# EAGLE design untitled (EAGLE 9.6.0)
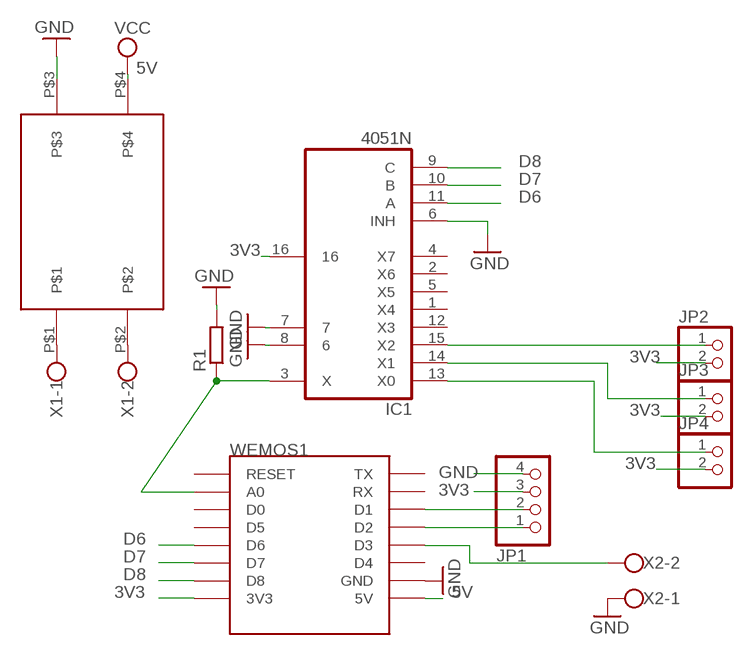
[diagram p0: schematic, sheet 1]

## Parts
IC1  4051N  [DIL16]
JP1  PINHD-1X4  [1X04]
JP2  PINHD-1X2  [1X02]
JP3  PINHD-1X2  [1X02]
JP4  PINHD-1X2  [1X02]
R1  R-EU_0207/10  [0207/10]
U$6  HLK-PM01  [HLK-PM01]
WEMOS1  WEMOS-D1-MINI  [WEMOS-D1-MINI]
X1  W237-102  [W237-102]
X2  W237-102  [W237-102]

## Nets
3V3: IC1.16 JP1.3 JP2.2 JP3.2 JP4.2 WEMOS1.3V3
5V: U$6.P$4 WEMOS1.5V ; supply symbol labelled VCC
D6: IC1.11(A) WEMOS1.D6
D7: IC1.10(B) WEMOS1.D7
D8: IC1.9(C) WEMOS1.D8
GND: IC1.6(INH) IC1.7 IC1.8 JP1.4 R1.2 U$6.P$3 WEMOS1.GND X2.1
N$1: IC1.3(X) R1.1 WEMOS1.A0
N$2: IC1.13(X0) JP4.1
N$3: IC1.14(X1) JP3.1
N$4: IC1.15(X2) JP2.1
N$5: JP1.1 WEMOS1.D2
N$6: JP1.2 WEMOS1.D1
N$7: U$6.P$1 X1.1
N$8: U$6.P$2 X1.2
N$9: WEMOS1.D3 X2.2
Unconnected: IC1.1(X4) IC1.2(X6) IC1.4(X7) IC1.5(X5) IC1.12(X3) WEMOS1.D0 WEMOS1.D4 WEMOS1.D5 WEMOS1.RESET WEMOS1.RX WEMOS1.TX

## Library data of the parts
IC1 = 40xx:4051: 8-channel ANALOG MULTIPLEXER
JP1 = pinhead:PINHD-1X4: PIN HEADER
JP2-JP4 = pinhead:PINHD-1X2: PIN HEADER
R1 = rcl:R-EU_: RESISTOR, European symbol; SPICEPREFIX: R
U$6 = diy-modules:HLK-PM01; HLK-PM01: HLK-PM01
WEMOS1 = esp8266modules:WEMOS-D1-MINI: WeMos.cc D1 mini ESP8266 module
X1 X2 = con-wago-500:W237-102: WAGO SCREW CLAMP; MPN: 237-102; OC_FARNELL: unknown; OC_NEWARK: 70K9898

## Net classes
0 default: width 0.406 mm, drill 0.406 mm, clearance 0.406 mm

## Board
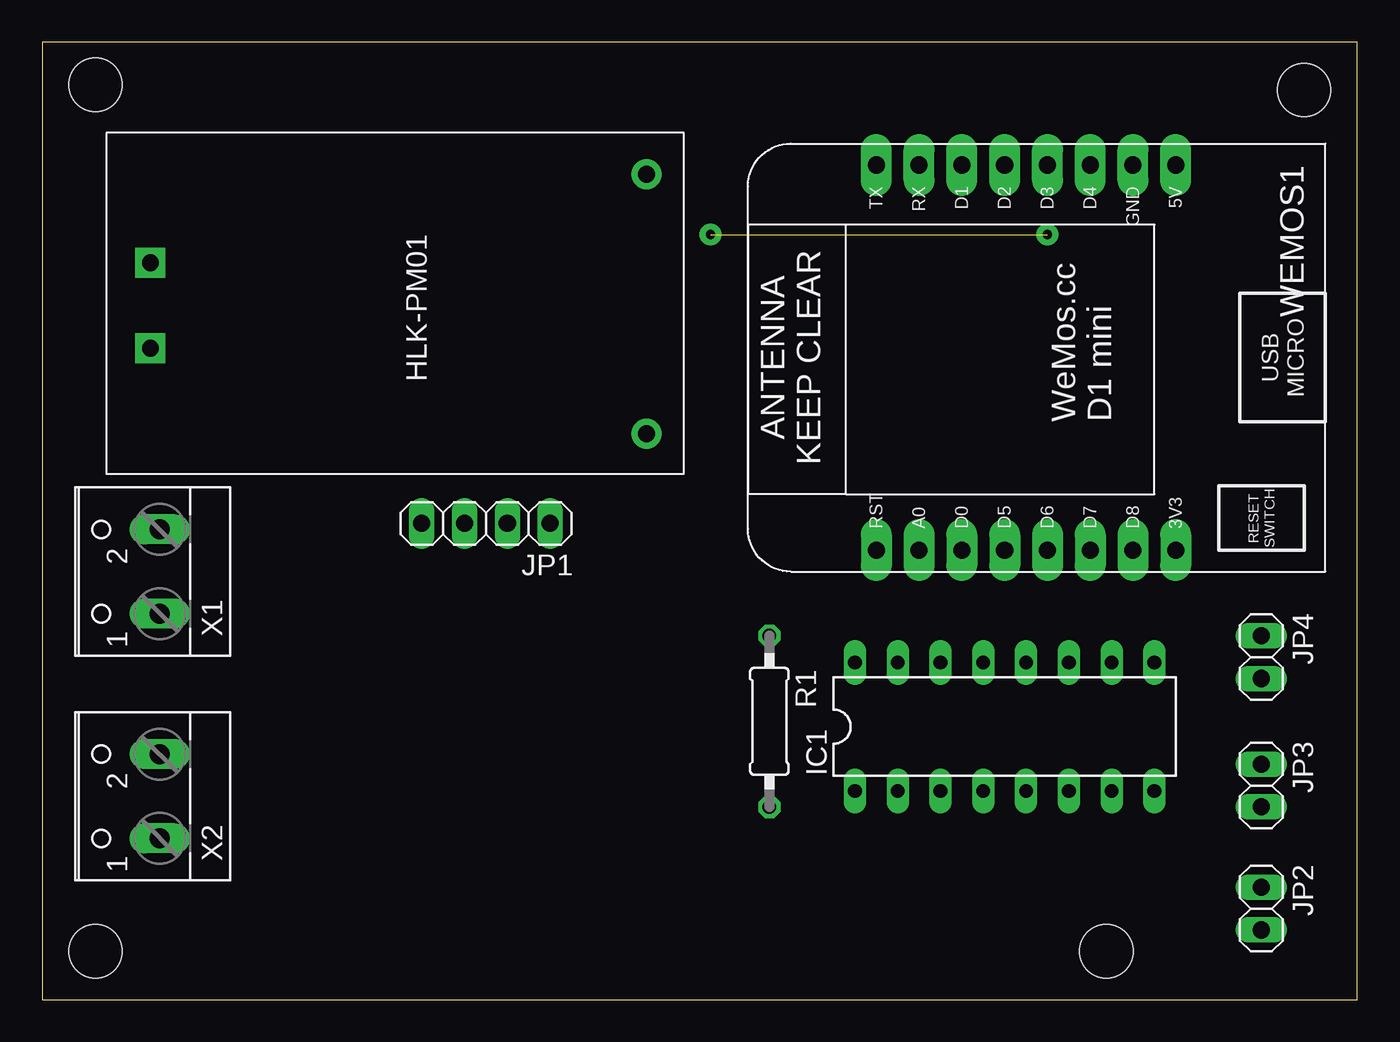
[diagram p1: board, top side]
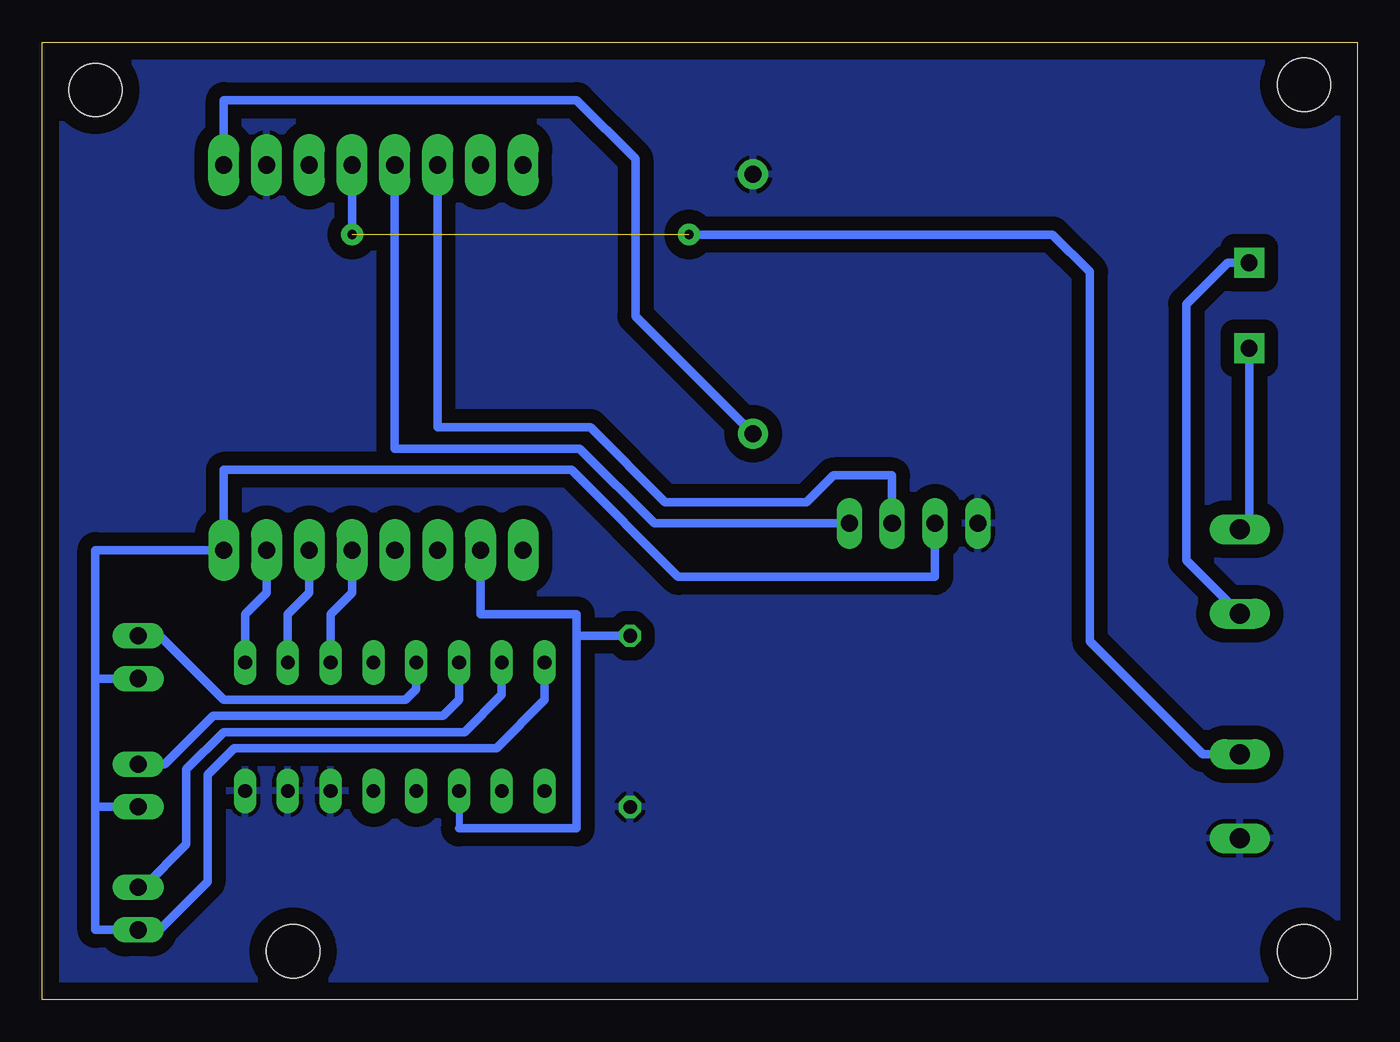
[diagram p2: board, bottom side, seen from below]

Size 78.09 x 56.82 mm. Coordinates in mm from the lower left corner, seen from the top.
Outline: 0,0 78.09,0 78.09,56.82 0,56.82 0,0
Copper layers (1*16): Top 0.035mm / dielectric 1.5mm / Bottom 0.035mm
Design rules "default": minimum track width 6mil, minimum drill 0.35mm, track to track 6mil, track to pad 6mil, pad to pad 6mil, via to via 6mil, smd to smd 6mil, copper to edge 40mil, drill to drill 6mil, minimum pad ring 10mil, minimum via ring 8mil, stop-mask expansion 4mil, vias tented up to drill 0mil, thermal gap 10mil
Holes 3.15 mm at 3.17,54.29 3.17,2.86 74.93,53.98 63.18,2.86

### Footprints (pad centres in the part's own frame; a part is rotated, then mirrored left to right if it is on the bottom)
DIL16 = drill 0.813 long: 1 -8.89,-3.81; 2 -6.35,-3.81; 3 -3.81,-3.81; 4 -1.27,-3.81; 5 1.27,-3.81; 6 3.81,-3.81; 7 6.35,-3.81; 8 8.89,-3.81; 9 8.89,3.81; 10 6.35,3.81; 11 3.81,3.81; 12 1.27,3.81; 13 -1.27,3.81; 14 -3.81,3.81; 15 -6.35,3.81; 16 -8.89,3.81
1X04 = drill 1.016 long: 1 -3.81,0; 2 -1.27,0; 3 1.27,0; 4 3.81,0
1X02 = drill 1.016 long: 1 -1.27,0; 2 1.27,0
0207/10 = drill 0.813 octagon: 1 -5.08,0; 2 5.08,0
HLK-PM01 = drill 1 pad 1.778 square: P$1 7.699,2.619; P$2 12.779,2.619 | drill 1 pad 1.778: P$3 2.461,32.068; P$4 17.859,32.068
WEMOS-D1-MINI = drill 1.016 pad 1.829 long: 3V3 -10.16,-10.16; 5V 12.7,-10.16; A0 -10.16,5.08; D0 -10.16,2.54; D1 12.7,2.54; D2 12.7,0; D3 12.7,-2.54; D4 12.7,-5.08; D5 -10.16,0; D6 -10.16,-2.54; D7 -10.16,-5.08; D8 -10.16,-7.62; GND 12.7,-7.62; RESET -10.16,7.62; RX 12.7,5.08; TX 12.7,7.62
W237-102 = drill 1.194 long: 1 -2.5,-1.27; 2 2.5,-1.27

### Placement (x,y rotation side)
IC1  57.15,16.19 0 top
JP1  26.35,28.26 180 top
JP2  72.39,5.4 270 top
JP3  72.39,12.7 270 top
JP4  72.39,20.32 270 top
R1  43.18,16.51 270 top
U$6  3.81,51.44 270 top
WEMOS1  57.15,36.83 90 top
X1  5.71,25.4 90 top
X2  5.71,12.06 90 top

### Tracks (layer width: path | path; a pad name or v marks a point on that pad's centre or on a via)
3V3
  Bottom 0.508: JP1.3 25.08,25.08 40.32,25.08 46.67,31.43 67.31,31.43 WEMOS1.3V3 74.93,26.67 74.93,19.05 | IC1.16 48.26,17.78 51.12,14.92 66.67,14.92 68.26,13.34 68.26,6.99 71.12,4.13 JP2.2 74.93,4.13 74.93,11.43 | 74.93,11.43 74.93,19.05 | JP4.2 74.93,19.05 | JP3.2 74.93,11.43
5V
  Bottom 0.508: WEMOS1.5V 67.31,53.38 46.35,53.38 42.86,49.89 42.86,40.56 U$6.P$4
D6
  Bottom 0.508: WEMOS1.D6 59.69,24.13 60.96,22.86 IC1.11
D7
  Bottom 0.508: WEMOS1.D7 62.23,24.13 63.5,22.86 IC1.10
D8
  Bottom 0.508: WEMOS1.D8 64.77,24.13 66.04,22.86 IC1.9
GND
  pour Bottom (isolate 0.813): 0,56.83 78.11,56.83 78.11,0 0,0
N$1
  Bottom 0.406: IC1.3 53.34,10.16
  Bottom 0.508: 53.34,10.16 46.35,10.16 46.35,21.59 | WEMOS1.A0 52.07,22.86 46.35,22.86 46.35,21.59 | R1.1 46.35,21.59
N$2
  Bottom 0.508: IC1.13 55.88,18.41 56.52,17.78 67.31,17.78 71.12,21.59 JP4.1
N$3
  Bottom 0.508: IC1.14 53.34,17.78 54.29,16.83 67.94,16.83 70.8,13.97 JP3.1
N$4
  Bottom 0.508: IC1.15 50.8,18.1 53.02,15.88 67.31,15.88 69.53,13.65 69.53,9.21 72.07,6.67 JP2.1
N$5
  Bottom 0.508: WEMOS1.D2 57.15,32.7 46.18,32.7 41.73,28.26 JP1.1
N$6
  Bottom 0.508: WEMOS1.D1 54.61,33.97 45.54,33.97 41.1,29.53 32.7,29.53 31.11,31.11 27.62,31.11 JP1.2
N$7
  Bottom 0.508: U$6.P$1 7.7,43.74 10.16,41.27 10.16,26.07 X1.1
N$8
  Bottom 0.508: U$6.P$2 6.43,28.46 X1.2
N$9  (via drill 0.55 pad 1.3)  (1 unrouted)
  Bottom 0.508: X2.2 9.17,14.56 15.88,21.27 15.88,43.18 18.1,45.4 v39.69,45.4 | WEMOS1.D3 v59.69,45.4